# Altium schematic sheet breeze_power.SchDoc: Breeze Quadcopter
size A4; Author: myyerrol; Organization: Team MicroDynamics; Address1: NWPU; Address2: Xi'an; Address3: Shannxi; Address4: China; Revision: V0.1; SheetNumber: 3; SheetTotal: 5
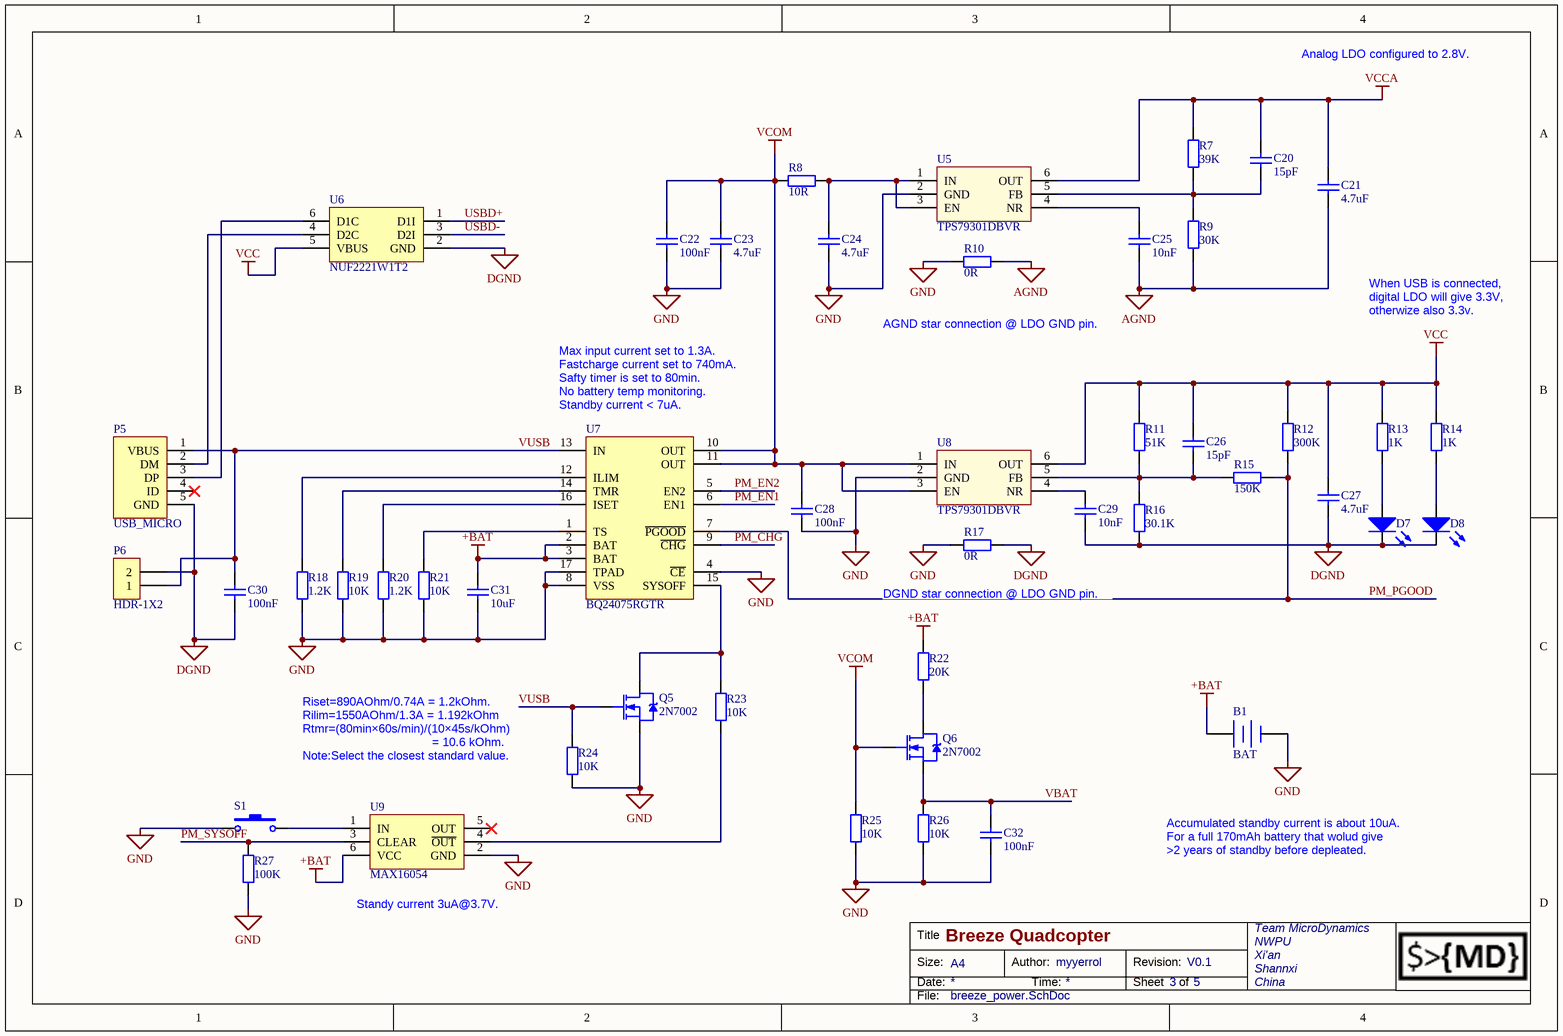
[diagram p0: breeze_power.SchDoc]

## Parts
B1  BAT  [HDR-1X2]
C20  value 15pF  [SMD-0603]  (hidden comment: CAP-0603)
C21  value 4.7uF  [SMD-0603]  (hidden comment: CAP-0603)
C22  value 100nF  [SMD-0603]  (hidden comment: CAP-0603)
C23  value 4.7uF  [SMD-0603]  (hidden comment: CAP-0603)
C24  value 4.7uF  [SMD-0603]  (hidden comment: CAP-0603)
C25  value 10nF  [SMD-0603]  (hidden comment: CAP-0603)
C26  value 15pF  [SMD-0603]  (hidden comment: CAP-0603)
C27  value 4.7uF  [SMD-0603]  (hidden comment: CAP-0603)
C28  value 100nF  [SMD-0603]  (hidden comment: CAP-0603)
C29  value 10nF  [SMD-0603]  (hidden comment: CAP-0603)
C30  value 100nF  [SMD-0603]  (hidden comment: CAP-0603)
C31  value 10uF  [SMD-0603]  (hidden comment: CAP-0603)
C32  value 100nF  [SMD-0603]  (hidden comment: CAP-0603)
D7  LED-0603  [SMD-0603]  (value not drawn)
D8  LED-0603  [SMD-0603]  (value not drawn)
P5  USB_MICRO  [USB_MICRO]
P6  HDR-1X2  [HDR-1X2]
Q5  2N7002  [SOT-23]
Q6  2N7002  [SOT-23]
R7  value 39K  [SMD-0603]  (hidden comment: RES-0603)
R8  value 10R  [SMD-0603]  (hidden comment: RES-0603)
R9  value 30K  [SMD-0603]  (hidden comment: RES-0603)
R10  value 0R  [SMD-0603]  (hidden comment: RES-0603)
R11  value 51K  [SMD-0603]  (hidden comment: RES-0603)
R12  value 300K  [SMD-0603]  (hidden comment: RES-0603)
R13  value 1K  [SMD-0603]  (hidden comment: RES-0603)
R14  value 1K  [SMD-0603]  (hidden comment: RES-0603)
R15  value 150K  [SMD-0603]  (hidden comment: RES-0603)
R16  value 30.1K  [SMD-0603]  (hidden comment: RES-0603)
R17  value 0R  [SMD-0603]  (hidden comment: RES-0603)
R18  value 1.2K  [SMD-0603]  (hidden comment: RES-0603)
R19  value 10K  [SMD-0603]  (hidden comment: RES-0603)
R20  value 1.2K  [SMD-0603]  (hidden comment: RES-0603)
R21  value 10K  [SMD-0603]  (hidden comment: RES-0603)
R22  value 20K  [SMD-0603]  (hidden comment: RES-0603)
R23  value 10K  [SMD-0603]  (hidden comment: RES-0603)
R24  value 10K  [SMD-0603]  (hidden comment: RES-0603)
R25  value 10K  [SMD-0603]  (hidden comment: RES-0603)
R26  value 10K  [SMD-0603]  (hidden comment: RES-0603)
R27  value 100K  [SMD-0603]  (hidden comment: RES-0603)
S1  SKRELGE010  [SKRELGE010]  (value not drawn)
U5  TPS79301DBVR  [SOT-23-6]
U6  NUF2221W1T2  [SOT-363]
U7  BQ24075RGTR  [VQFN-16]
U8  TPS79301DBVR  [SOT-23-6]
U9  MAX16054  [SOT-23-6]

## Nets
+BAT: B1.1(+) C31.1 R22.1 U7.2(BAT) U7.3(BAT) U9.6(VCC)
AGND: C21.2 C25.2 R9.2 R10.2
DGND: C27.2 C29.2 C30.2 D7.2(K) D8.2(K) P5.5(GND) P6.2 R16.2 R17.2 U6.2(GND)
GND: B1.2(-) C22.2 C23.2 C24.2 C28.2 C31.2 C32.2 Q5.2(S) R10.1 R17.1 R18.2 R19.2 R20.2 R21.2 R24.2 R25.2 R26.2 R27.2 S1.1 U5.2(GND) U7.4(~{CE}) U7.8(VSS) U7.17(TPAD) U8.2(GND) U9.2(GND)
VCC: C26.1 C27.1 R11.1 R12.1 R13.1 R14.1 U6.5(VBUS) U8.6(OUT)
VCCA: C20.1 C21.1 R7.1 U5.6(OUT)
VCOM: C22.1 C23.1 C28.1 Q6.1(G) R8.1 R25.1 U7.10(OUT) U7.11(OUT) U8.1(IN) U8.3(EN)
PM_CHG: U7.9(~{CHG})
PM_EN1: U7.6(EN1)
PM_EN2: U7.5(EN2)
PM_PGOOD: R12.2 R15.2 U7.7(~{PGOOD})
PM_SYSOFF: R27.1 U9.3(CLEAR)
USBD+: U6.1(D1I)
USBD-: U6.3(D2I)
VBAT: C32.1 Q6.2(S) R26.1
VUSB: C30.1 P5.1(VBUS) P6.1 Q5.1(G) R24.1 U7.13(IN)
NetC20_2: C20.2 R7.2 R9.1 U5.5(FB)
NetC24_1: C24.1 R8.2 U5.1(IN) U5.3(EN)
NetC25_1: C25.1 U5.4(NR)
NetC26_2: C26.2 R11.2 R15.1 R16.1 U8.5(FB)
NetC29_1: C29.1 U8.4(NR)
NetD7_1: D7.1(A) R13.2
NetD8_1: D8.1(A) R14.2
NetP5_2: P5.2(DM) U6.4(D2C)
NetP5_3: P5.3(DP) U6.6(D1C)
NetQ5_3: Q5.3(D) R23.1 U7.15(SYSOFF)
NetQ6_3: Q6.3(D) R22.2
NetR18_1: R18.1 U7.12(ILIM)
NetR19_1: R19.1 U7.14(TMR)
NetR20_1: R20.1 U7.16(ISET)
NetR21_1: R21.1 U7.1(TS)
NetR23_2: R23.2 U9.4(~{OUT})
NetS1_2: S1.2 U9.1(IN)

Not connected (* = marked no-connect by the designer): P5 4(ID)*; U9 5(OUT)*

## Notes on the sheet
- Analog LDO configured to 2.8V.
- When USB is connected, digital LDO will give 3.3V, otherwize also 3.3v.
- AGND star connection @ LDO GND pin.
- (near U7) Max input current set to 1.3A.
  Fastcharge current set to 740mA.
  Safty timer is set to 80min.
  No battery temp monitoring.
  Standby current < 7uA.
- DGND star connection @ LDO GND pin.
- Riset=890AOhm/0.74A = 1.2kOhm.
  Rilim=1550AOhm/1.3A = 1.192kOhm
  Rtmr=(80min×60s/min)/(10×45s/kOhm)
  = 10.6 kOhm.
  Note:Select the closest standard value.
- Accumulated standby current is about 10uA.
  For a full 170mAh battery that wolud give
  >2 years of standby before depleated.
- (near U9) Standy current 3uA@3.7V.
- Title
- Size:
- Date:
- A4
- Author:
- Time:
- Revision:
- Sheet
- of
- File:

## Library data of the parts
B1 = BAT: Battery
C20-C32 = CAP-0603: Capacitor
D7 D8 = LED-0603: LED
P5 = USB_MICRO: Micro USB
P6 = HDR-1X2: Header 1X2
Q5 Q6 = 2N7002: N-Channel Enhancement Mode Field Effect Transistor
R7-R27 = RES-0603: Resistor
S1 = SKRELGE010: Switch
U5 U8 = TPS79301DBVR: 200-mA RF Low-Dropout Regulator
U6 = NUF2221W1T2: USB Upstream Terminator  with ESD Protection
U7 = BQ24075RGTR: 1.5-A USB-Friendly Li-Ion Battery Charger and Power-Path Management IC
U9 = MAX16054: On/Off Controller with Debounce and ±15kV ESD Protection